# Altium schematic sheet Table_for_Analog_In.SchDoc
size A4; SheetNumber: 6; SheetTotal: 6
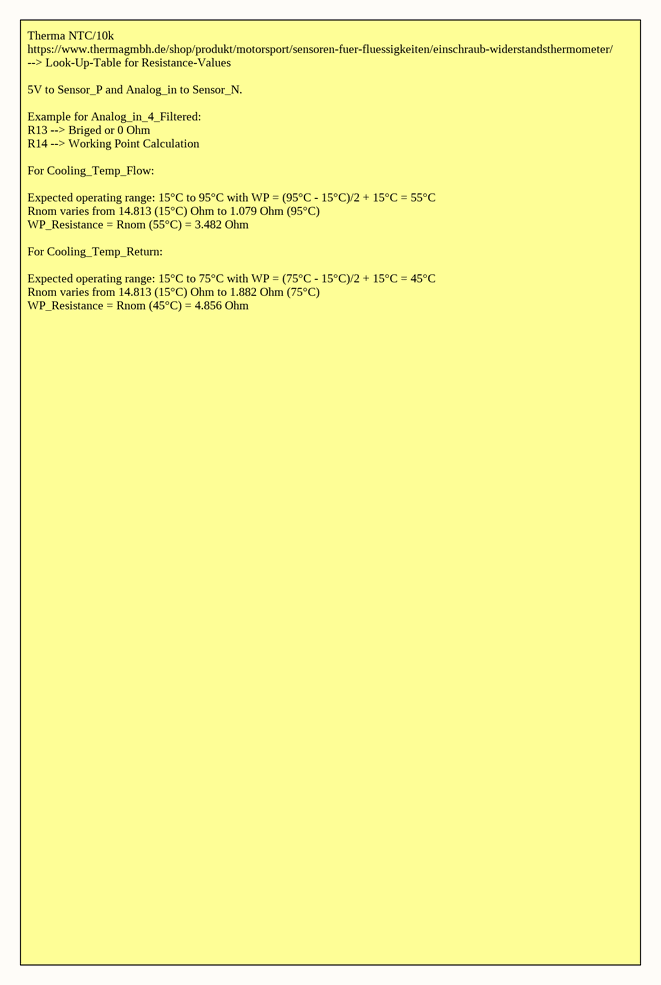
[diagram p0: Table_for_Analog_In.SchDoc]

## Notes on the sheet
- Therma NTC/10k
  https://www.thermagmbh.de/shop/produkt/motorsport/sensoren-fuer-fluessigkeiten/einschraub-widerstandsthermometer/
  --> Look-Up-Table for Resistance-Values
  5V to Sensor_P and Analog_in to Sensor_N.
  Example for Analog_in_4_Filtered:
  R13 --> Briged or 0 Ohm
  R14 --> Working Point Calculation
  For Cooling_Temp_Flow:
  Expected operating range: 15°C to 95°C with WP = (95°C - 15°C)/2 + 15°C = 55°C
  Rnom varies from 14.813 (15°C) Ohm to 1.079 Ohm (95°C)
  WP_Resistance = Rnom (55°C) = 3.482 Ohm
  For Cooling_Temp_Return:
  Expected operating range: 15°C to 75°C with WP = (75°C - 15°C)/2 + 15°C = 45°C
  Rnom varies from 14.813 (15°C) Ohm to 1.882 Ohm (75°C)
  WP_Resistance = Rnom (45°C) = 4.856 Ohm